# Altium schematic sheet TDesktop.SchDoc: LiveDesign Evaluation - EvalBoard Tester
size A4; Organization: Altium Limited; Address1: L3, 12a Rodborough Rd; Address2: Frenchs Forest; Address3: NSW; Address4: Australia 2086; DocumentNumber: 12; SheetNumber: 12; SheetTotal: 16
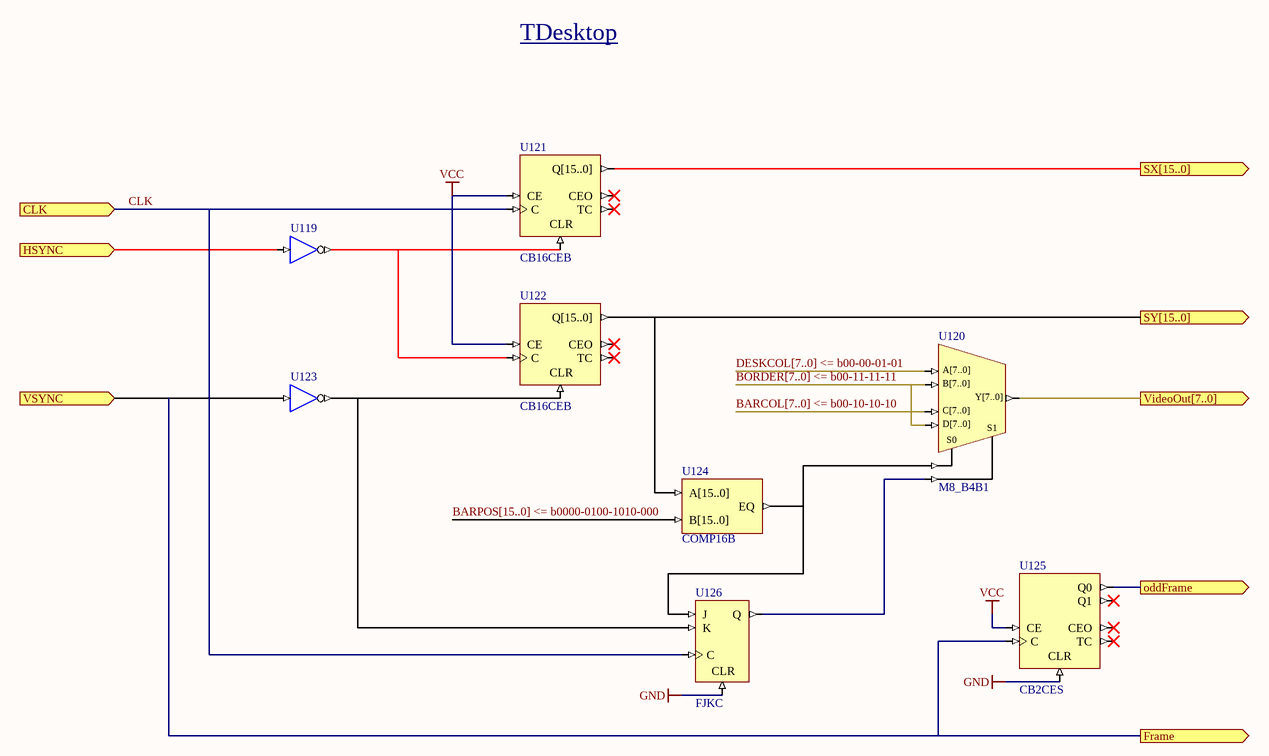
[diagram p0: TDesktop.SchDoc]

## Parts
U119  INV  (value not drawn)
U120  M8_B4B1
U121  CB16CEB
U122  CB16CEB
U123  BUF  (value not drawn)
U124  COMP16B
U125  CB2CES
U126  FJKC

## Ports
CLK (in), Frame (out), HSYNC (in), oddFrame (out), SX[15..0] (out), SY[15..0] (out), VideoOut[7..0] (out), VSYNC (in)

## Nets
GND: U125.CLR U126.CLR
VCC: U121.CE U122.CE U125.CE
BARCOL[7..0] <= b00-10-10-10: U120.C[7..0]
BARPOS[15..0] <= b0000-0100-1010-000: U124.B[15..0]
BORDER[7..0] <= b00-11-11-11: U120.B[7..0] U120.D[7..0]
CLK: U121.C U126.C ; port CLK
DESKCOL[7..0] <= b00-00-01-01: U120.A[7..0]
Frame: U123.I U125.C ; port VSYNC, port Frame
HSYNC: U119.I ; port HSYNC
oddFrame: U125.Q0 ; port oddFrame
SX[15..0]: U121.Q[15..0] ; port SX[15..0]
SY[15..0]: U122.Q[15..0] U124.A[15..0] ; port SY[15..0]
VideoOut[7..0]: U120.Y[7..0] ; port VideoOut[7..0]
NetU119_O: U119.O U121.CLR U122.C
NetU120_S0: U120.S0 U124.EQ U126.J
NetU120_S1: U120.S1 U126.Q
NetU122_CLR: U122.CLR U123.O U126.K

Not connected (* = marked no-connect by the designer): U121 CEO* TC*; U122 CEO* TC*; U125 CEO* Q1* TC*

## Buses and harness runs
bus BARCOL[7..0] <= b00-10-10-10
bus BARPOS[15..0] <= b0000-0100-1010-000
bus BORDER[7..0] <= b00-11-11-11
bus DESKCOL[7..0] <= b00-00-01-01

## Notes on the sheet
- TDesktop
- Title
- Size:
- Date:
- A4
- Number:
- Time:
- Revision:
- Sheet
- of
- File:

## Library data of the parts
U119 U123 = INV: Inverter; ArchiveName: GENERIC; VHDLIB_SIM: GENERIC_LIB; Published: 29-Jan-2004; Publisher: Altium Limited; Xilinx Equivalent: INV; Core Revision: 1.00.00
U120 = M8_B4B1: 4x8-Bit Bus to 1x8-Bit Bus Multiplexer; ArchiveName: GENERIC; VHDLIB_SIM: GENERIC_LIB; Published: 29-Jan-2004; Publisher: Altium Limited; Core Revision: 1.00.00
U121 U122 = CB16CEB: 16-Bit Cascadable Binary Counters with Clock Enable and Asynchronous Clear, Bus Version; Xilinx Equivalent: CB16CE; ArchiveName: GENERIC; VHDLIB_SIM: GENERIC_LIB; Published: 29-Jan-2004; Publisher: Altium Limited; Core Revision: 1.00.00
U124 = COMP16B: 16-Bit Identity Comparator, Bus Version; Xilinx Equivalent: COMP16; ArchiveName: GENERIC; VHDLIB_SIM: GENERIC_LIB; Published: 29-Jan-2004; Publisher: Altium Limited; Core Revision: 1.00.00
U125 = CB2CES: 2-Bit Cascadable Binary Counters with Clock Enable and Asynchronous Clear, Single Pin Version; Xilinx Equivalent: CB2CE; ArchiveName: GENERIC; VHDLIB_SIM: GENERIC_LIB; Published: 29-Jan-2004; Publisher: Altium Limited; Core Revision: 1.00.00
U126 = FJKC: J-K Flip-Flop with Asynchronous Clear; ArchiveName: GENERIC; VHDLIB_SIM: GENERIC_LIB; Published: 29-Jan-2004; Publisher: Altium Limited; Xilinx Equivalent: FJKC; Core Revision: 1.00.00